# Altium schematic sheet HighSideDriver.SchDoc
size A4
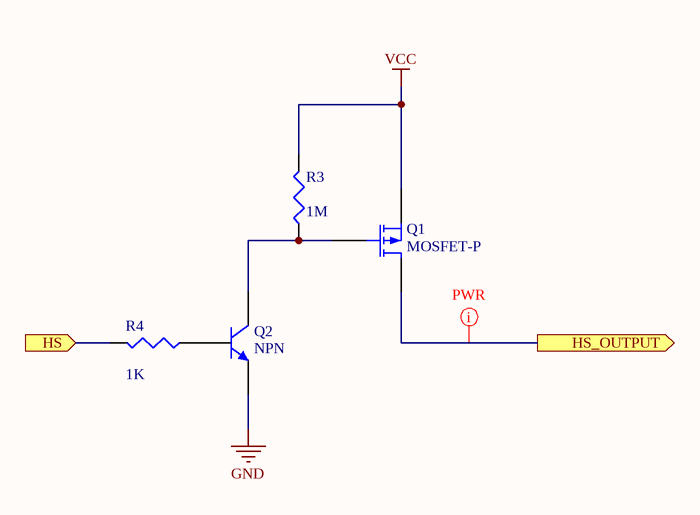
[diagram p0: HighSideDriver.SchDoc]

## Parts
Q1  MOSFET-P  [SOT23_M]
Q2  NPN  [SOT-23B_M]
R3  value 1M  [1608[0603]]  (hidden comment: Res3)
R4  value 1K  [1608[0603]]  (hidden comment: Res3)

## Ports
HS (in), HS_OUTPUT (out)

## Nets
GND: Q2.3(E)
VCC: Q1.3(S) R3.2
HS: R4.2 ; port HS
HS_OUTPUT: Q1.1(D) ; port HS_OUTPUT
NetQ1_2: Q1.2(G) Q2.1(C) R3.1
NetQ2_2: Q2.2(B) R4.1

## Layout directives
rule Width Constraint [Pref Width = 1mm    Min Width = 0.381mm    Max Width = 1mm]: HS_OUTPUT

## Library data of the parts
Q1 = MOSFET-P: P-Channel MOSFET; pin to pad: 2>3 3>2; Published: 8-Jun-2000; LatestRevisionDate: 17-Jul-2002; LatestRevisionNote: Re-released for DXP Platform.; PackageVersion: 1995/1996; PackageReference: E3; Publisher: Altium Limited; PackageDescription: TO, Flat Index; 3 In-Line, Axial Leads; Body Dia. 4.6mm; Lead Dia. 0.5 mm (max)
Q2 = NPN: NPN Bipolar Transistor; pin to pad: 1>3 2>1 3>2; Published: 8-Jun-2000; LatestRevisionDate: 17-Jul-2002; LatestRevisionNote: Re-released for DXP Platform.; PackageReference: TO-226-AA; Publisher: Altium Limited; PackageDescription: TO, Flat Index; 3 In-Line, Axial Leads; Body Dia. 4.8mm; Leads 0.55 x 0.51 mm (max); Code_JEDEC: TO-226-AA
R3 R4 = Res3: Resistor; Published: 8-Jun-2000; LatestRevisionDate: 29-May-2009; LatestRevisionNote: IPC-7351 Footprint Added.; PackageReference: J1-0603; Publisher: Altium Limited; PackageDescription: Chip Resistor